# Altium schematic sheet SideSensors.SchDoc
size A4; SheetNumber: 1; SheetTotal: 1
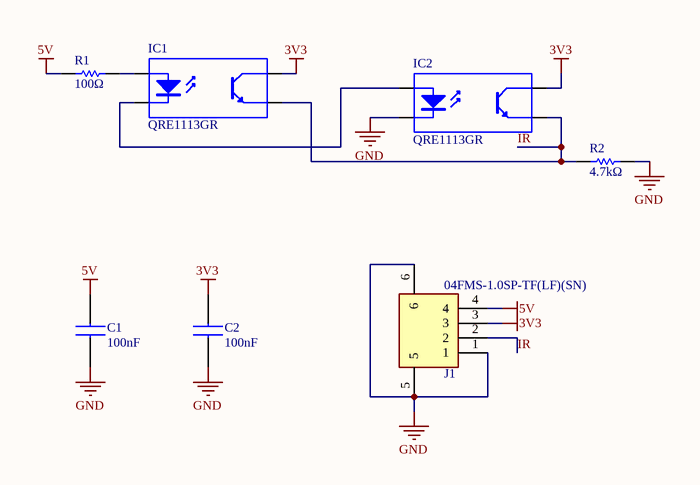
[diagram p0: SideSensors.SchDoc]

## Parts
C1  value 100nF  [CAP0805]  (hidden comment: CC0805KRX7R9BB104)
C2  value 100nF  [CAP0805]  (hidden comment: CC0805KRX7R9BB104)
IC1  QRE1113GR  [SOIC4- SIDE]
IC2  QRE1113GR  [SOIC4- SIDE]
J1  04FMS-1.0SP-TF(LF)(SN)  [FPC-SMD-P1.00-4P_JST]
R1  value 100Ω  [RES0805]  (hidden comment: 0805W8F1000T5E)
R2  value 4.7kΩ  [RES0805]  (hidden comment: 0805W8F4701T5E)

## Nets
3V3: C2.1 IC1.3(C) IC2.3(C) J1.3
5V: C1.1 J1.4 R1.1
GND: C1.2 C2.2 IC2.2(K) J1.1 J1.5 J1.6 R2.2
IR: IC1.4(E) IC2.4(E) J1.2 R2.1
NetIC1_1: IC1.1(A) R1.2
NetIC1_2: IC1.2(K) IC2.1(A)

## Library data of the parts
C1 C2 = CC0805KRX7R9BB104: Multilayer Ceramic Capacitors MLCC - SMD/SMT 50 V 0.1uF X7R 0805 10%; Manufacturer_Name: YAGEO; Geometry.Height: 0.95mm; Manufacturer_Part_Number: CC0805KRX7R9BB104; Datasheet Link: https://www.yageo.com/upload/media/product/productsearch/datasheet/mlcc/UPY-GPHC_X7R_6.3V-to-50V_20.pdf; LCSC: C49678
IC1 IC2 = QRE1113GR_S: IC IR-SENSOR; Manufacturer: ON Semiconductor; Wavelength: 940nm; If - Forward Current Max: 50mA; Rise Time: 20us; Vf - Forward Voltage: 1.4V; Sensing Distance (máx): 5mm; Vce - Collector/Emitter Voltage Max: 30V; Ic - Collector Current Max: 20mA; Vr - Reverse Voltage: 5V; Pd - Power Dissipation:: 75mW; Library Control - Checked Footprint: Yes; Library Control - Last Project that Used: Follow-Final; Library Control - Person that Checked Footprint: Lucas; Library Control - Person that did the Last Update Footprint: Mateus(Dimas); Supplier 1: Mouser; Part Number: QRE1113GR; Category: Phototransistor; Price: 1=1,150, 10=0,955, 100=0,542 (USD); Package / Case: SMD-4 Gull Wing; Operating Temperature: -25°C ~ 85°C; Supplier Part Number 1: 512-QRE1113GR; If - Forward Curren t(test): 20mA; Library Ref: Phototransistor; Library Control - Checked Schematic: Yes; Library Control - Last Update: 24/04/2021 00:25; Library Control - Person that Checked Schematic: Lucas; Library Control - Person that did the Last Update Schematic: Mateus(Dimas); ComponentLink1Description: Datasheet; ComponentLink1URL: https://br.mouser.com/datasheet/2/308/QRE1113_D-1814544.pdf; ComponentLink2Description: Mouser Link; ComponentLink2URL: https://br.mouser.com/ProductDetail/ON-Semiconductor-Fairchild/QRE1113GR?qs=Qb0BA3xILekkPpSVC5x7uQ%3D%3D
J1 = 04FMS-1.0SP-TF(LF)(SN): Drawer Type 4P Dual-sided contacts / top and bottom connection Horizontal attachment 1mm SMD,P=1mm,Surface Mount，Right Angle FFC, FPC (Flat Flexible) Connector Assemblies ROHS; Manufacturer_Name: JST; Geometry.Height: 2.80mm; Manufacturer_Part_Number: 04FMS-1.0SP-TF(LF)(SN); LCSC: C265033; ComponentLink1Description: JLCPCB; ComponentLink1URL: https://jlcpcb.com/partdetail/Jst-04FMS_1_0SP_TF_LF_SN/C265033; ComponentLink2Description: Datasheet; ComponentLink2URL: https://www.lcsc.com/datasheet/lcsc_datasheet_1811061308_JST-04FMS-1-0SP-TF-LF-SN_C265033.pdf
R1 = 0805W8F1000T5E: 125mW Thick Film Resistors 150V ±100ppm/℃ ±1% 100Ω 0805 Chip Resistor - Surface Mount ROHS; Manufacturer_Name: UNI-ROYAL; Geometry.Height: 0.95mm; Manufacturer_Part_Number: 0805W8F1000T5E; Datasheet Link: https://wmsc.lcsc.com/wmsc/upload/file/pdf/v2/lcsc/2206010216_UNI-ROYAL-Uniroyal-Elec-0805W8F1000T5E_C17408.pdf; LCSC: C17408
R2 = 0805W8F4701T5E: 125mW Thick Film Resistors 150V ±100ppm/℃ ±1% 4.7kΩ 0805 Chip Resistor - Surface Mount ROHS; Manufacturer_Name: UNI-ROYAL; Geometry.Height: 0.95mm; Manufacturer_Part_Number: 0805W8F4701T5E; Datasheet Link: https://wmsc.lcsc.com/wmsc/upload/file/pdf/v2/lcsc/2206010200_UNI-ROYAL-Uniroyal-Elec-0805W8F4701T5E_C17673.pdf; LCSC: C17673